# Altium schematic sheet Top-Sheet.SchDoc
size A4; DocumentNumber: 1; SheetNumber: 1; SheetTotal: 8
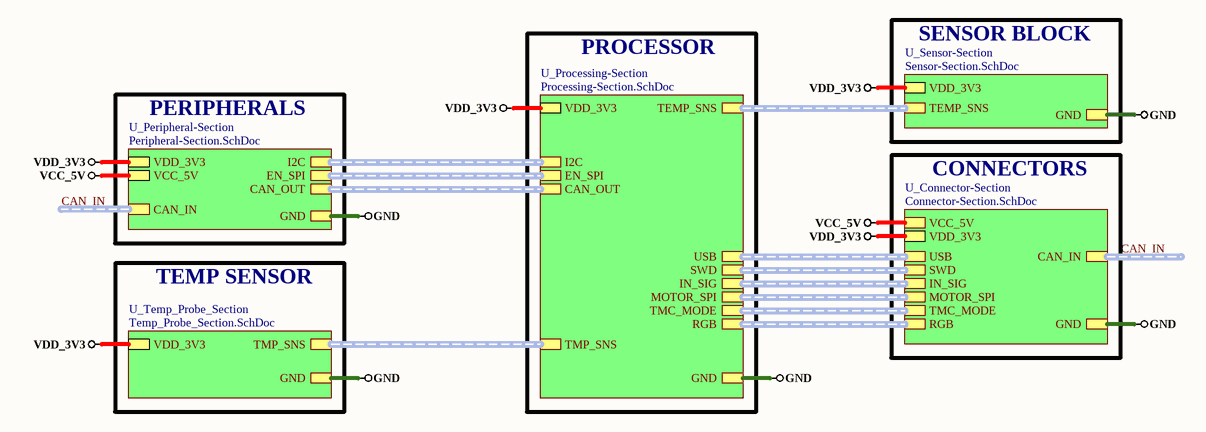
[diagram p0: Top-Sheet.SchDoc]

## Sub-sheets
U_Connector-Section = Connector-Section.SchDoc: USB (harness USB), VDD_3V3, GND, CAN_IN (harness CAN_IN), MOTOR_SPI (harness MOTOR_SPI), IN_SIG (harness IN_SIG), SWD (harness SWD), TMC_MODE (harness TMC_MODE), VCC_5V, RGB (harness RGB)
U_Peripheral-Section = Peripheral-Section.SchDoc: VDD_3V3, GND, VCC_5V, EN_SPI (harness EN_SPI), CAN_OUT (harness CAN_OUT), CAN_IN (harness CAN_IN), I2C (harness I2C)
U_Processing-Section = Processing-Section.SchDoc: MOTOR_SPI (harness MOTOR_SPI), USB (harness USB), EN_SPI (harness EN_SPI), VDD_3V3, GND, CAN_OUT (harness CAN_OUT), TEMP_SNS (harness TEMP_SNS), IN_SIG (harness IN_SIG), I2C (harness I2C), SWD (harness SWD), TMC_MODE (harness TMC_MODE), RGB (harness RGB), TMP_SNS (harness TMP_SNS)
U_Sensor-Section = Sensor-Section.SchDoc: TEMP_SNS (harness TEMP_SNS), VDD_3V3, GND
U_Temp_Probe_Section = Temp_Probe_Section.SchDoc: VDD_3V3, GND, TMP_SNS (harness TMP_SNS)

## Nets
GND: sheet U_Peripheral-Section/GND, sheet U_Processing-Section/GND, sheet U_Connector-Section/GND, sheet U_Sensor-Section/GND, sheet U_Temp_Probe_Section/GND
VCC_5V: sheet U_Peripheral-Section/VCC_5V, sheet U_Connector-Section/VCC_5V
VDD_3V3: sheet U_Peripheral-Section/VDD_3V3, sheet U_Processing-Section/VDD_3V3, sheet U_Connector-Section/VDD_3V3, sheet U_Sensor-Section/VDD_3V3, sheet U_Temp_Probe_Section/VDD_3V3

## Buses and harness runs
harness CAN_IN = sheet U_Connector-Section/CAN_IN
harness CAN_IN = sheet U_Peripheral-Section/CAN_IN
harness sheet U_Connector-Section/IN_SIG = sheet U_Processing-Section/IN_SIG
harness sheet U_Connector-Section/MOTOR_SPI = sheet U_Processing-Section/MOTOR_SPI
harness sheet U_Connector-Section/RGB = sheet U_Processing-Section/RGB
harness sheet U_Connector-Section/SWD = sheet U_Processing-Section/SWD
harness sheet U_Connector-Section/TMC_MODE = sheet U_Processing-Section/TMC_MODE
harness sheet U_Connector-Section/USB = sheet U_Processing-Section/USB
harness sheet U_Peripheral-Section/CAN_OUT = sheet U_Processing-Section/CAN_OUT
harness sheet U_Peripheral-Section/EN_SPI = sheet U_Processing-Section/EN_SPI
harness sheet U_Peripheral-Section/I2C = sheet U_Processing-Section/I2C
harness sheet U_Processing-Section/TEMP_SNS = sheet U_Sensor-Section/TEMP_SNS
harness sheet U_Processing-Section/TMP_SNS = sheet U_Temp_Probe_Section/TMP_SNS

## Notes on the sheet
- PROCESSOR
- SENSOR BLOCK
- PERIPHERALS
- CONNECTORS
- TEMP SENSOR